# Altium schematic sheet Button.SchDoc
size A
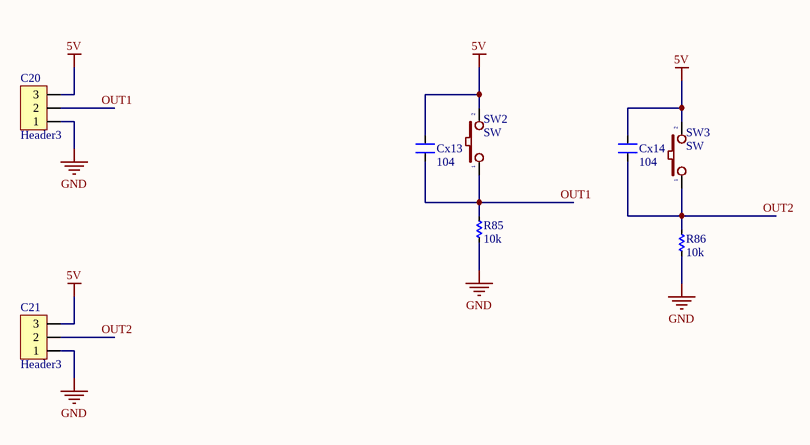
[diagram p0: Button.SchDoc]

## Parts
C20  Header3  [Header3]
C21  Header3  [Header3]
Cx13  104  [CN-SMD-0805]
Cx14  104  [CN-SMD-0805]
R85  10k  [RES-SMD-0805]
R86  10k  [RES-SMD-0805]
SW2  SW  [SW1-SMD]
SW3  SW  [SW1-SMD]

## Nets
5V: C20.3 C21.3 Cx13.2 Cx14.2 SW2.2 SW3.2
GND: C20.1 C21.1 R85.2 R86.2
OUT1: C20.2 Cx13.1 R85.1 SW2.1
OUT2: C21.2 Cx14.1 R86.1 SW3.1

## Library data of the parts
C20 C21 = Header3: Header IDC, 3 x 1 Pin Vertical 2.54mm Pitch (Non-Boxed, Male); Manufacturer: W¨¹rth Elektronik eiSos GmbH; partNo: 613002143121; ComponentLink1 Description: Manufacturer; ComponentLink2 Description: Datasheet; NoPins: 02; Created Date: 29 March 2013; ComponentLink1URL: http://www.we-online.com; ComponentLink2URL: http://katalog.we-online.de/em/datasheet/6130xx143121.pdf; Created by: Karrer Zheng
Cx13 Cx14 = CN: Value: 33pF
R85 R86 = Res-SMD: Resistor; Manufacturer: Generic Components; Class: Passive; Published: 08/06/2000; Publisher: Altium Hobart Technology Centre
SW2 SW3 = SW2: Switch button 2 pin; Value: SW chip 2 pin